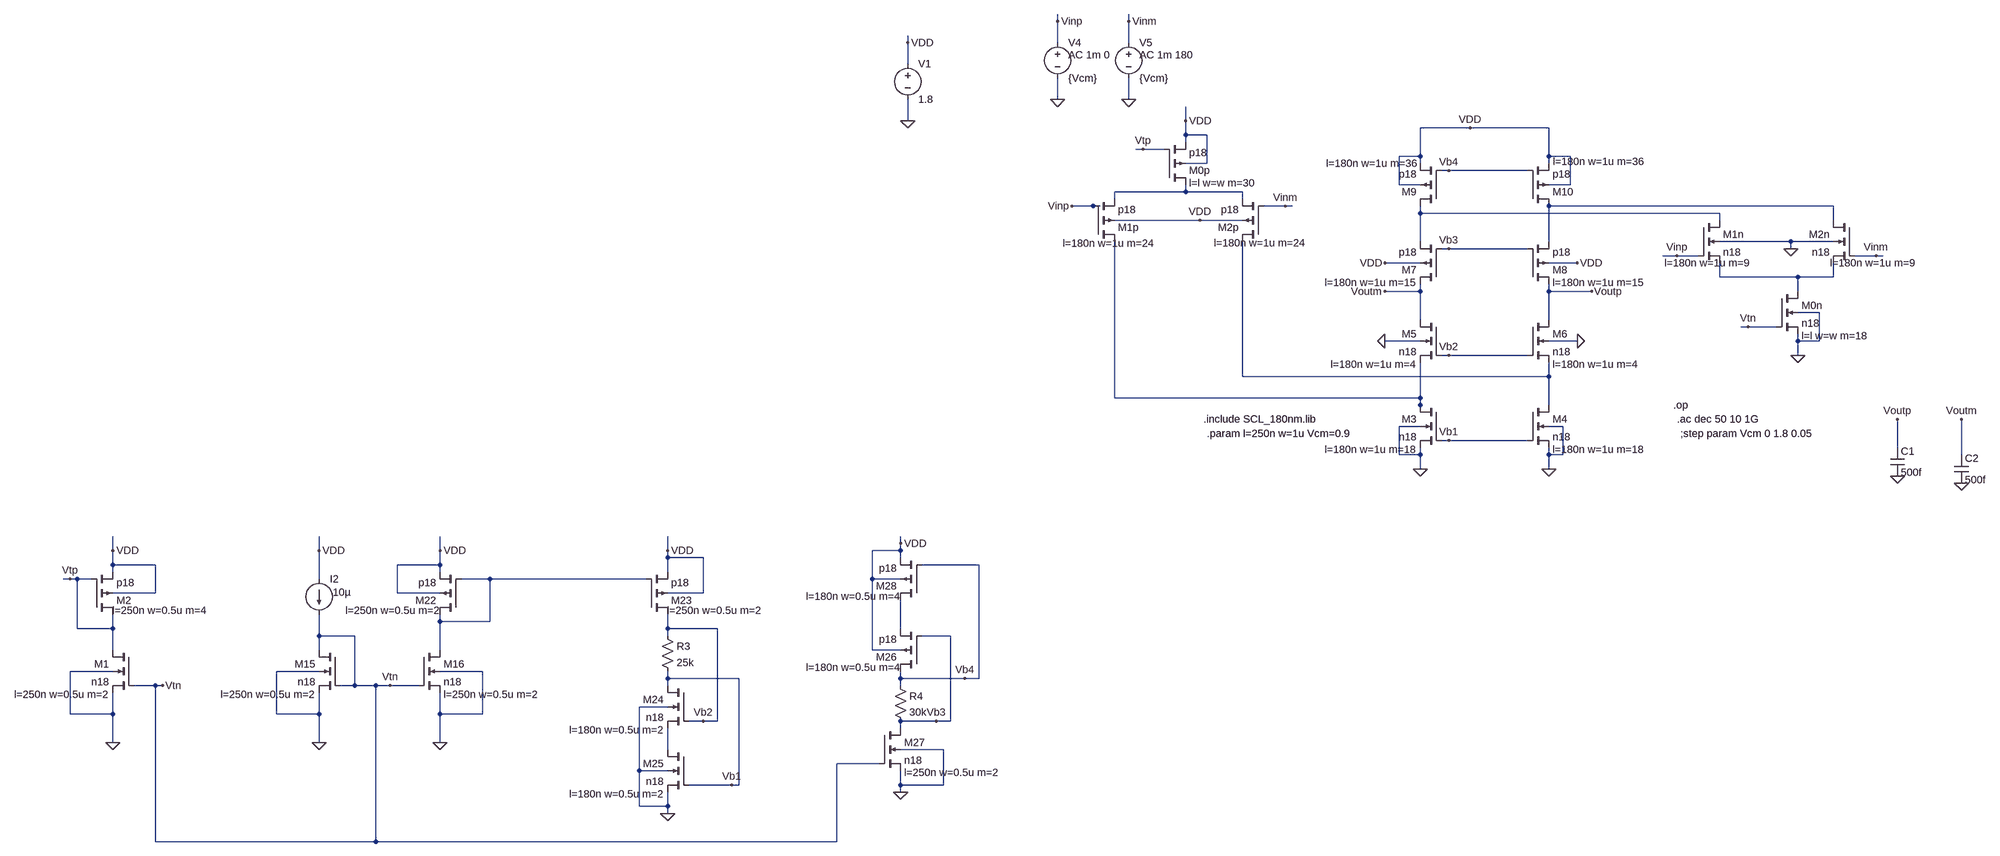
[diagram p0: schematic rail_to_rail_NMOS_PMOS.asc]
rail_to_rail_NMOS_PMOS.asc, the LTspice schematic file:
Version 4
SHEET 1 1728 1368
WIRE -464 -576 -464 -592
WIRE -304 -576 -304 -592
WIRE -976 -528 -976 -544
WIRE -464 -528 -464 -576
WIRE -304 -528 -304 -576
WIRE -976 -480 -976 -528
WIRE -464 -400 -464 -448
WIRE -304 -400 -304 -448
WIRE -976 -352 -976 -400
WIRE -176 -352 -176 -384
WIRE 464 -336 352 -336
WIRE 656 -336 464 -336
WIRE -176 -320 -176 -352
WIRE -128 -320 -176 -320
WIRE -176 -304 -176 -320
WIRE -272 -288 -288 -288
WIRE -224 -288 -272 -288
WIRE 352 -272 352 -336
WIRE 352 -272 304 -272
WIRE 656 -272 656 -336
WIRE 704 -272 656 -272
WIRE -128 -256 -128 -320
WIRE -128 -256 -176 -256
WIRE 352 -256 352 -272
WIRE 656 -256 656 -272
WIRE 416 -240 400 -240
WIRE 608 -240 416 -240
WIRE 304 -208 304 -272
WIRE 352 -208 304 -208
WIRE 704 -208 704 -272
WIRE 704 -208 656 -208
WIRE -176 -192 -176 -208
WIRE -176 -192 -336 -192
WIRE -48 -192 -176 -192
WIRE -336 -176 -336 -192
WIRE -48 -176 -48 -192
WIRE -384 -160 -432 -160
WIRE -368 -160 -384 -160
WIRE 48 -160 0 -160
WIRE 64 -160 48 -160
WIRE 1296 -160 656 -160
WIRE 352 -144 352 -160
WIRE 1040 -144 352 -144
WIRE -144 -128 -336 -128
WIRE -48 -128 -144 -128
WIRE 1040 -128 1040 -144
WIRE 1296 -128 1296 -160
WIRE 352 -80 352 -144
WIRE 656 -80 656 -160
WIRE 1200 -80 1040 -80
WIRE 1296 -80 1200 -80
WIRE 416 -64 400 -64
WIRE 608 -64 416 -64
WIRE 1200 -64 1200 -80
WIRE 944 -48 912 -48
WIRE 992 -48 944 -48
WIRE 1392 -48 1344 -48
WIRE 1408 -48 1392 -48
WIRE 352 -32 272 -32
WIRE 720 -32 656 -32
WIRE 1040 0 1040 -32
WIRE 1216 0 1040 0
WIRE 1296 0 1296 -32
WIRE 1296 0 1216 0
WIRE 352 32 352 16
WIRE 352 32 272 32
WIRE 656 32 656 16
WIRE 752 32 656 32
WIRE 1216 32 1216 0
WIRE 1264 80 1216 80
WIRE 352 96 352 32
WIRE 656 96 656 32
WIRE 1104 112 1088 112
WIRE 1168 112 1104 112
WIRE 352 144 272 144
WIRE 720 144 656 144
WIRE 1216 144 1216 128
WIRE 1264 144 1264 80
WIRE 1264 144 1216 144
WIRE 416 176 400 176
WIRE 608 176 416 176
WIRE 1216 176 1216 144
WIRE -48 224 -48 -80
WIRE 656 224 656 192
WIRE 656 224 -48 224
WIRE -336 272 -336 -80
WIRE 352 272 352 192
WIRE 352 272 -336 272
WIRE 352 288 352 272
WIRE 656 288 656 224
WIRE 352 304 352 288
WIRE 352 336 304 336
WIRE 688 336 656 336
WIRE 416 368 400 368
WIRE 608 368 416 368
WIRE 1440 384 1440 320
WIRE 304 400 304 336
WIRE 352 400 352 384
WIRE 352 400 304 400
WIRE 656 400 656 384
WIRE 688 400 688 336
WIRE 688 400 656 400
WIRE 1584 400 1584 320
WIRE 352 432 352 400
WIRE 656 432 656 400
WIRE -992 688 -992 672
WIRE -2784 704 -2784 672
WIRE -2320 704 -2320 672
WIRE -2048 704 -2048 672
WIRE -1536 704 -1536 672
WIRE -992 704 -992 688
WIRE -992 704 -1056 704
WIRE -1536 720 -1536 704
WIRE -1456 720 -1536 720
WIRE -992 720 -992 704
WIRE -2784 736 -2784 704
WIRE -2688 736 -2784 736
WIRE -2048 736 -2048 704
WIRE -2048 736 -2144 736
WIRE -816 736 -944 736
WIRE -2784 752 -2784 736
WIRE -2048 752 -2048 736
WIRE -1536 752 -1536 720
WIRE -2880 768 -2896 768
WIRE -2864 768 -2880 768
WIRE -2832 768 -2864 768
WIRE -2320 768 -2320 704
WIRE -1936 768 -2000 768
WIRE -1584 768 -1936 768
WIRE -1056 768 -1056 704
WIRE -992 768 -1056 768
WIRE -2688 800 -2688 736
WIRE -2688 800 -2784 800
WIRE -2144 800 -2144 736
WIRE -2048 800 -2144 800
WIRE -1456 800 -1456 720
WIRE -1456 800 -1536 800
WIRE -2048 864 -2048 848
WIRE -1936 864 -1936 768
WIRE -1936 864 -2048 864
WIRE -2864 880 -2864 768
WIRE -2784 880 -2784 848
WIRE -2784 880 -2864 880
WIRE -1536 880 -1536 848
WIRE -1424 880 -1536 880
WIRE -992 880 -992 816
WIRE -2320 896 -2320 848
WIRE -2240 896 -2320 896
WIRE -1536 896 -1536 880
WIRE -880 896 -944 896
WIRE -2784 928 -2784 880
WIRE -2320 928 -2320 896
WIRE -2048 928 -2048 864
WIRE -1056 928 -1056 768
WIRE -992 928 -1056 928
WIRE -2784 976 -2880 976
WIRE -2320 976 -2416 976
WIRE -1952 976 -2048 976
WIRE -1536 992 -1536 976
WIRE -1376 992 -1536 992
WIRE -992 992 -992 976
WIRE -848 992 -992 992
WIRE -816 992 -816 736
WIRE -816 992 -848 992
WIRE -2688 1008 -2736 1008
WIRE -2672 1008 -2688 1008
WIRE -2240 1008 -2240 896
WIRE -2240 1008 -2272 1008
WIRE -2192 1008 -2240 1008
WIRE -2160 1008 -2192 1008
WIRE -2096 1008 -2160 1008
WIRE -1536 1008 -1536 992
WIRE -992 1008 -992 992
WIRE -1536 1056 -1600 1056
WIRE -2880 1072 -2880 976
WIRE -2784 1072 -2784 1024
WIRE -2784 1072 -2880 1072
WIRE -2416 1072 -2416 976
WIRE -2320 1072 -2320 1024
WIRE -2320 1072 -2416 1072
WIRE -2048 1072 -2048 1024
WIRE -1952 1072 -1952 976
WIRE -1952 1072 -2048 1072
WIRE -1456 1088 -1488 1088
WIRE -1424 1088 -1424 880
WIRE -1424 1088 -1456 1088
WIRE -912 1088 -992 1088
WIRE -880 1088 -880 896
WIRE -880 1088 -912 1088
WIRE -992 1104 -992 1088
WIRE -2784 1136 -2784 1072
WIRE -2320 1136 -2320 1072
WIRE -2048 1136 -2048 1072
WIRE -1536 1152 -1536 1104
WIRE -896 1152 -992 1152
WIRE -1040 1184 -1136 1184
WIRE -1600 1200 -1600 1056
WIRE -1536 1200 -1600 1200
WIRE -1392 1232 -1488 1232
WIRE -1376 1232 -1376 992
WIRE -1376 1232 -1392 1232
WIRE -992 1232 -992 1200
WIRE -896 1232 -896 1152
WIRE -896 1232 -992 1232
WIRE -992 1248 -992 1232
WIRE -1600 1280 -1600 1200
WIRE -1536 1280 -1536 1248
WIRE -1536 1280 -1600 1280
WIRE -1536 1296 -1536 1280
WIRE -2688 1360 -2688 1008
WIRE -2192 1360 -2192 1008
WIRE -2192 1360 -2688 1360
WIRE -1136 1360 -1136 1184
WIRE -1136 1360 -2192 1360
FLAG -176 -352 VDD
FLAG 352 432 0
FLAG 656 432 0
FLAG 1216 176 0
FLAG 464 -336 VDD
FLAG 272 -32 VDD
FLAG 720 -32 VDD
FLAG -144 -128 VDD
FLAG 720 144 0
FLAG 272 144 0
FLAG -976 -352 0
FLAG -976 -528 VDD
FLAG 416 368 Vb1
FLAG 416 176 Vb2
FLAG 416 -64 Vb3
FLAG 416 -240 Vb4
FLAG -272 -288 Vtp
FLAG 1104 112 Vtn
FLAG 1392 -48 Vinm
FLAG 48 -160 Vinm
FLAG -432 -160 Vinp
FLAG 944 -48 Vinp
FLAG 272 32 Voutm
FLAG 752 32 Voutp
FLAG -464 -400 0
FLAG -464 -576 Vinp
FLAG -304 -400 0
FLAG -304 -576 Vinm
FLAG 1440 448 0
FLAG 1584 464 0
FLAG 1584 320 Voutm
FLAG 1440 320 Voutp
FLAG 1200 -64 0
FLAG -2320 1136 0
FLAG -2320 704 VDD
FLAG -2048 1136 0
FLAG -2048 704 VDD
FLAG -1536 704 VDD
FLAG -1536 1296 0
FLAG -992 1248 0
FLAG -992 688 VDD
FLAG -1392 1232 Vb1
FLAG -1456 1088 Vb2
FLAG -912 1088 Vb3
FLAG -848 992 Vb4
FLAG -2160 1008 Vtn
FLAG -2784 1136 0
FLAG -2784 704 VDD
FLAG -2672 1008 Vtn
FLAG -2880 768 Vtp
DATAFLAG 560 -240 ""
DATAFLAG 592 -64 ""
DATAFLAG 576 176 ""
DATAFLAG 576 368 ""
DATAFLAG 1232 0 ""
DATAFLAG 1024 -144 ""
DATAFLAG 1184 -160 ""
DATAFLAG -816 800 ""
SYMBOL pmos4 -224 -208 M180
WINDOW 123 56 4 Left 2
SYMATTR Value2 l=l w=w m=30
SYMATTR InstName M0p
SYMATTR Value p18
SYMBOL pmos4 608 16 M180
WINDOW 123 56 4 Left 2
SYMATTR Value2 l=180n w=1u m=15
SYMATTR InstName M8
SYMATTR Value p18
SYMBOL pmos4 400 16 R180
WINDOW 123 56 4 Left 2
SYMATTR Value2 l=180n w=1u m=15
SYMATTR InstName M7
SYMATTR Value p18
SYMBOL pmos4 608 -160 M180
WINDOW 123 57 100 Left 2
SYMATTR Value2 l=180n w=1u m=36
SYMATTR InstName M10
SYMATTR Value p18
SYMBOL pmos4 400 -160 R180
WINDOW 123 53 96 Left 2
SYMATTR Value2 l=180n w=1u m=36
SYMATTR InstName M9
SYMATTR Value p18
SYMBOL nmos4 608 96 R0
WINDOW 123 56 100 Left 2
SYMATTR Value2 l=180n w=1u m=4
SYMATTR InstName M6
SYMATTR Value n18
SYMBOL nmos4 608 288 R0
WINDOW 123 56 100 Left 2
SYMATTR Value2 l=180n w=1u m=18
SYMATTR InstName M4
SYMATTR Value n18
SYMBOL nmos4 400 96 M0
WINDOW 123 56 100 Left 2
SYMATTR Value2 l=180n w=1u m=4
SYMATTR InstName M5
SYMATTR Value n18
SYMBOL nmos4 400 288 M0
WINDOW 123 56 100 Left 2
SYMATTR Value2 l=180n w=1u m=18
SYMATTR InstName M3
SYMATTR Value n18
SYMBOL pmos4 0 -80 R180
WINDOW 123 -95 -3 Left 2
SYMATTR Value2 l=180n w=1u m=24
SYMATTR InstName M2p
SYMATTR Value p18
SYMBOL pmos4 -384 -80 M180
WINDOW 123 -68 -4 Left 2
SYMATTR Value2 l=180n w=1u m=24
SYMATTR InstName M1p
SYMATTR Value p18
SYMBOL nmos4 1344 -128 M0
WINDOW 123 -138 96 Left 2
SYMATTR Value2 l=180n w=1u m=9
SYMATTR InstName M2n
SYMATTR Value n18
SYMBOL nmos4 992 -128 R0
WINDOW 123 -76 96 Left 2
SYMATTR Value2 l=180n w=1u m=9
SYMATTR InstName M1n
SYMATTR Value n18
SYMBOL nmos4 1168 32 R0
WINDOW 123 56 100 Left 2
SYMATTR Value2 l=l w=w m=18
SYMATTR InstName M0n
SYMATTR Value n18
SYMBOL voltage -976 -496 R0
WINDOW 123 0 0 Left 0
WINDOW 39 0 0 Left 0
SYMATTR InstName V1
SYMATTR Value 1.8
SYMBOL voltage -464 -544 R0
WINDOW 123 24 44 Left 2
WINDOW 39 0 0 Left 0
SYMATTR Value2 AC 1m 0
SYMATTR InstName V4
SYMATTR Value {Vcm}
SYMBOL voltage -304 -544 R0
WINDOW 123 24 44 Left 2
WINDOW 39 0 0 Left 0
SYMATTR Value2 AC 1m 180
SYMATTR InstName V5
SYMATTR Value {Vcm}
SYMBOL cap 1424 384 R0
SYMATTR InstName C1
SYMATTR Value 500f
SYMBOL cap 1568 400 R0
SYMATTR InstName C2
SYMATTR Value 500f
SYMBOL current -2320 768 R0
WINDOW 123 0 0 Left 0
WINDOW 39 0 0 Left 0
WINDOW 3 31 30 Left 2
SYMATTR Value 10µ
SYMATTR InstName I2
SYMBOL nmos4 -2272 928 M0
WINDOW 123 56 100 Left 2
SYMATTR Value2 l=250n w=0.5u m=2
SYMATTR InstName M15
SYMATTR Value n18
SYMBOL nmos4 -2096 928 R0
WINDOW 123 56 100 Left 2
SYMATTR Value2 l=250n w=0.5u m=2
SYMATTR InstName M16
SYMATTR Value n18
SYMBOL pmos4 -2000 848 R180
WINDOW 123 47 9 Left 2
SYMATTR Value2 l=250n w=0.5u m=2
SYMATTR InstName M22
SYMATTR Value p18
SYMBOL pmos4 -1584 848 M180
WINDOW 123 47 9 Left 2
SYMATTR Value2 l=250n w=0.5u m=2
SYMATTR InstName M23
SYMATTR Value p18
SYMBOL res -1552 880 R0
SYMATTR InstName R3
SYMATTR Value 25k
SYMBOL res -1008 992 R0
SYMATTR InstName R4
SYMATTR Value 30k
SYMBOL nmos4 -1488 1008 M0
WINDOW 123 56 100 Left 2
SYMATTR Value2 l=180n w=0.5u m=2
SYMATTR InstName M24
SYMATTR Value n18
SYMBOL nmos4 -1488 1152 M0
WINDOW 123 56 100 Left 2
SYMATTR Value2 l=180n w=0.5u m=2
SYMATTR InstName M25
SYMATTR Value n18
SYMBOL pmos4 -944 976 R180
WINDOW 123 47 9 Left 2
SYMATTR Value2 l=180n w=0.5u m=4
SYMATTR InstName M26
SYMATTR Value p18
SYMBOL nmos4 -1040 1104 R0
WINDOW 123 56 100 Left 2
SYMATTR Value2 l=250n w=0.5u m=2
SYMATTR InstName M27
SYMATTR Value n18
SYMBOL pmos4 -944 816 R180
WINDOW 123 47 9 Left 2
SYMATTR Value2 l=180n w=0.5u m=4
SYMATTR InstName M28
SYMATTR Value p18
SYMBOL nmos4 -2736 928 M0
WINDOW 123 56 100 Left 2
SYMATTR Value2 l=250n w=0.5u m=2
SYMATTR InstName M1
SYMATTR Value n18
SYMBOL pmos4 -2832 848 M180
WINDOW 123 47 9 Left 2
SYMATTR Value2 l=250n w=0.5u m=4
SYMATTR InstName M2
SYMATTR Value p18
TEXT -136 320 Left 2 !.include SCL_180nm.lib
TEXT -128 352 Left 2 !.param l=250n w=1u Vcm=0.9
TEXT 936 288 Left 2 !.op
TEXT 944 320 Left 2 !.ac dec 50 10 1G
TEXT 952 352 Left 2 !;step param Vcm 0 1.8 0.05

The netlist it stands for:
* rail_to_rail_NMOS_PMOS.asc
M0p N001 Vtp VDD VDD p18 l=l w=w m=30
M8 Voutp Vb3 N002 VDD p18 l=180n w=1u m=15
M7 Voutm Vb3 N003 VDD p18 l=180n w=1u m=15
M10 N002 Vb4 VDD VDD p18 l=180n w=1u m=36
M9 N003 Vb4 VDD VDD p18 l=180n w=1u m=36
M6 Voutp Vb2 N005 0 n18 l=180n w=1u m=4
M4 N005 Vb1 0 0 n18 l=180n w=1u m=18
M5 Voutm Vb2 N006 0 n18 l=180n w=1u m=4
M3 N006 Vb1 0 0 n18 l=180n w=1u m=18
M2p N005 Vinm N001 VDD p18 l=180n w=1u m=24
M1p N006 Vinp N001 VDD p18 l=180n w=1u m=24
M2n N002 Vinm N004 0 n18 l=180n w=1u m=9
M1n N003 Vinp N004 0 n18 l=180n w=1u m=9
M0n N004 Vtn 0 0 n18 l=l w=w m=18
V1 VDD 0 1.8
V4 Vinp 0 {Vcm} AC 1m 0
V5 Vinm 0 {Vcm} AC 1m 180
C1 Voutp 0 500f
C2 Voutm 0 500f
I2 VDD Vtn 10µ
M15 Vtn Vtn 0 0 n18 l=250n w=0.5u m=2
M16 N007 Vtn 0 0 n18 l=250n w=0.5u m=2
M22 N007 N007 VDD VDD p18 l=250n w=0.5u m=2
M23 Vb2 N007 VDD VDD p18 l=250n w=0.5u m=2
R3 Vb2 Vb1 25k
R4 Vb4 Vb3 30k
M24 Vb1 Vb2 N009 0 n18 l=180n w=0.5u m=2
M25 N009 Vb1 0 0 n18 l=180n w=0.5u m=2
M26 Vb4 Vb3 N008 VDD p18 l=180n w=0.5u m=4
M27 Vb3 Vtn 0 0 n18 l=250n w=0.5u m=2
M28 N008 Vb4 VDD VDD p18 l=180n w=0.5u m=4
M1 Vtp Vtn 0 0 n18 l=250n w=0.5u m=2
M2 Vtp Vtp VDD VDD p18 l=250n w=0.5u m=4
.model NMOS NMOS
.model PMOS PMOS
.lib standard.mos
.include SCL_180nm.lib
.param l=250n w=1u Vcm=0.9
.op
.ac dec 50 10 1G
;step param Vcm 0 1.8 0.05
.backanno
.end